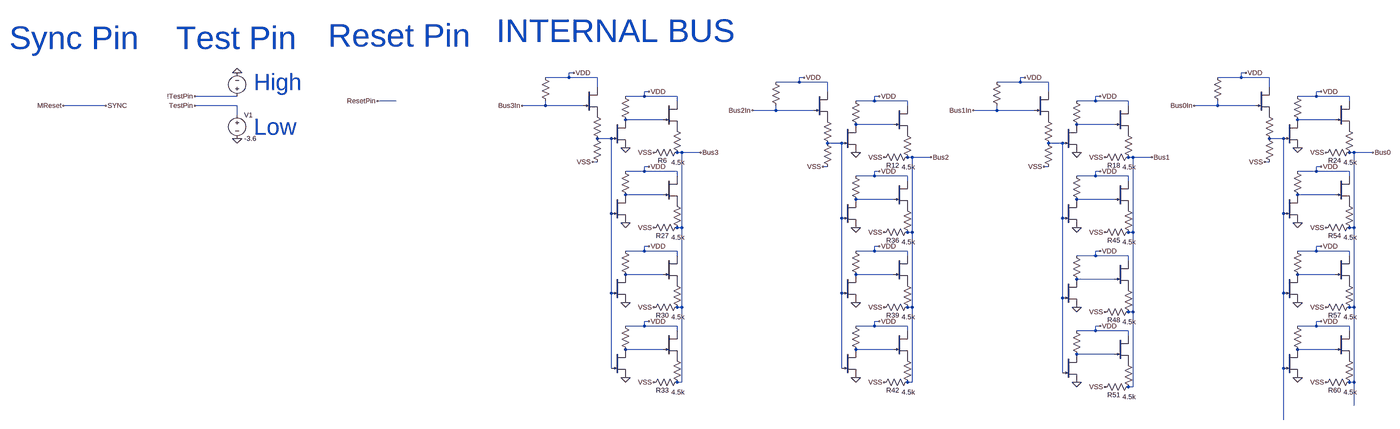
[diagram p0: schematic pins.asc, whole sheet]
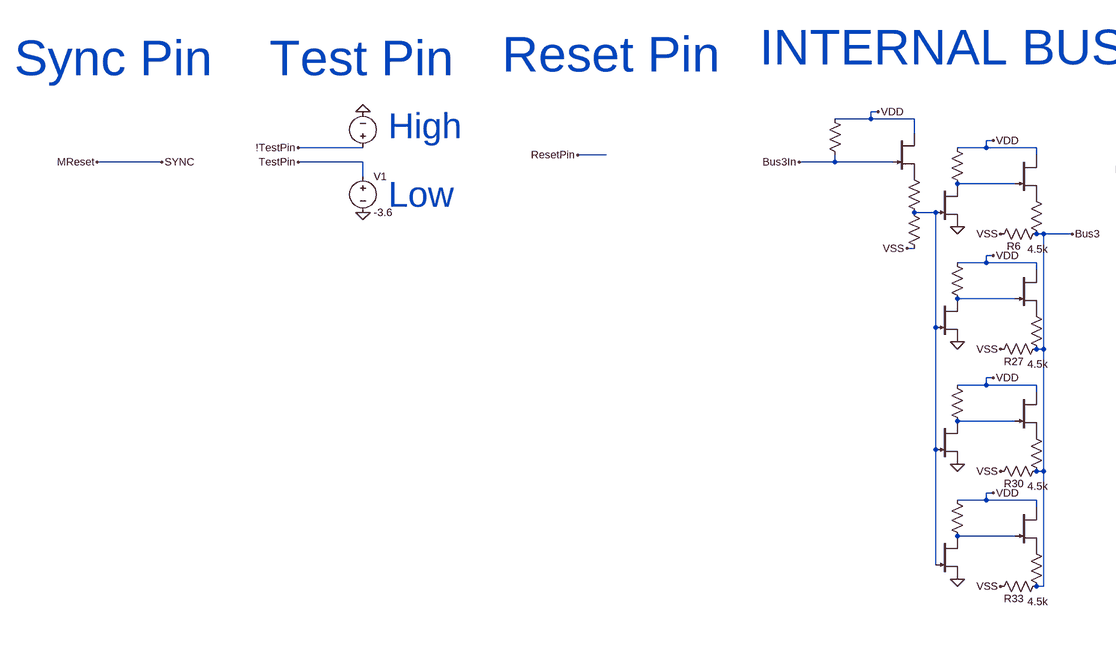
[diagram p1: schematic pins.asc, part, row 1 of 1, column 1 of 2]
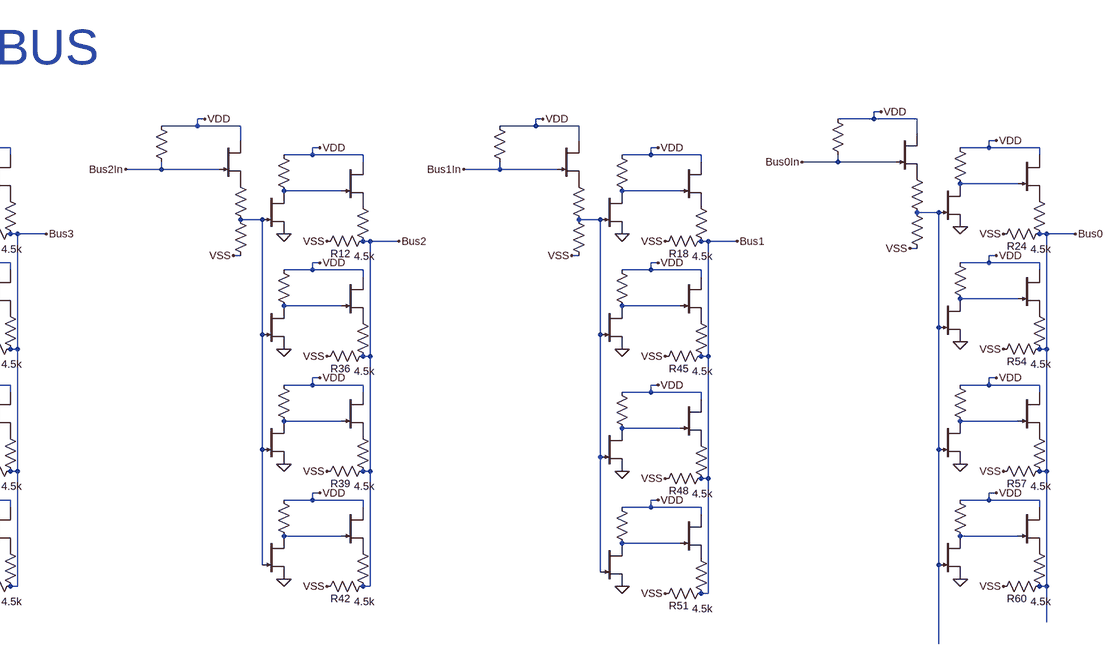
[diagram p2: schematic pins.asc, part, row 1 of 1, column 2 of 2]
pins.asc, the LTspice schematic file:
Version 4.1
SHEET 1 109444 42780
WIRE 21760 -5312 21744 -5312
WIRE 24048 -5312 24032 -5312
WIRE 21744 -5296 21744 -5312
WIRE 21744 -5296 21664 -5296
WIRE 21840 -5296 21744 -5296
WIRE 22544 -5296 22528 -5296
WIRE 23296 -5296 23280 -5296
WIRE 24032 -5296 24032 -5312
WIRE 24032 -5296 23952 -5296
WIRE 24128 -5296 24032 -5296
WIRE 22528 -5280 22528 -5296
WIRE 22528 -5280 22448 -5280
WIRE 22624 -5280 22528 -5280
WIRE 23280 -5280 23280 -5296
WIRE 23280 -5280 23200 -5280
WIRE 23376 -5280 23280 -5280
WIRE 21840 -5264 21840 -5296
WIRE 24128 -5264 24128 -5296
WIRE 22016 -5248 22000 -5248
WIRE 22624 -5248 22624 -5280
WIRE 23376 -5248 23376 -5280
WIRE 24304 -5248 24288 -5248
WIRE 20064 -5232 19920 -5232
WIRE 22000 -5232 22000 -5248
WIRE 22000 -5232 21936 -5232
WIRE 22112 -5232 22000 -5232
WIRE 22800 -5232 22784 -5232
WIRE 23552 -5232 23536 -5232
WIRE 24288 -5232 24288 -5248
WIRE 24288 -5232 24224 -5232
WIRE 24400 -5232 24288 -5232
WIRE 20944 -5216 20880 -5216
WIRE 22112 -5216 22112 -5232
WIRE 22784 -5216 22784 -5232
WIRE 22784 -5216 22720 -5216
WIRE 22896 -5216 22784 -5216
WIRE 23536 -5216 23536 -5232
WIRE 23536 -5216 23472 -5216
WIRE 23648 -5216 23536 -5216
WIRE 24400 -5216 24400 -5232
WIRE 19440 -5200 19296 -5200
WIRE 20064 -5200 19920 -5200
WIRE 21664 -5200 21664 -5216
WIRE 21664 -5200 21584 -5200
WIRE 21792 -5200 21664 -5200
WIRE 22896 -5200 22896 -5216
WIRE 23648 -5200 23648 -5216
WIRE 23952 -5200 23952 -5216
WIRE 23952 -5200 23872 -5200
WIRE 24080 -5200 23952 -5200
WIRE 22448 -5184 22448 -5200
WIRE 22448 -5184 22368 -5184
WIRE 22576 -5184 22448 -5184
WIRE 23200 -5184 23200 -5200
WIRE 23200 -5184 23120 -5184
WIRE 23328 -5184 23200 -5184
WIRE 20064 -5168 20064 -5200
WIRE 22064 -5152 21936 -5152
WIRE 24352 -5152 24224 -5152
WIRE 22848 -5136 22720 -5136
WIRE 23600 -5136 23472 -5136
WIRE 21888 -5088 21840 -5088
WIRE 24176 -5088 24128 -5088
WIRE 22672 -5072 22624 -5072
WIRE 23424 -5072 23376 -5072
WIRE 22128 -5040 22112 -5040
WIRE 22192 -5040 22128 -5040
WIRE 24416 -5040 24400 -5040
WIRE 24480 -5040 24416 -5040
WIRE 22912 -5024 22896 -5024
WIRE 22976 -5024 22912 -5024
WIRE 23664 -5024 23648 -5024
WIRE 23728 -5024 23664 -5024
WIRE 21840 -5008 21824 -5008
WIRE 24128 -5008 24112 -5008
WIRE 22016 -4992 22000 -4992
WIRE 22624 -4992 22608 -4992
WIRE 23376 -4992 23360 -4992
WIRE 24304 -4992 24288 -4992
WIRE 22000 -4976 22000 -4992
WIRE 22000 -4976 21936 -4976
WIRE 22112 -4976 22000 -4976
WIRE 22800 -4976 22784 -4976
WIRE 23552 -4976 23536 -4976
WIRE 24288 -4976 24288 -4992
WIRE 24288 -4976 24224 -4976
WIRE 24400 -4976 24288 -4976
WIRE 22112 -4960 22112 -4976
WIRE 22784 -4960 22784 -4976
WIRE 22784 -4960 22720 -4960
WIRE 22896 -4960 22784 -4960
WIRE 23536 -4960 23536 -4976
WIRE 23536 -4960 23472 -4960
WIRE 23648 -4960 23536 -4960
WIRE 24400 -4960 24400 -4976
WIRE 22896 -4944 22896 -4960
WIRE 23648 -4944 23648 -4960
WIRE 22064 -4896 21936 -4896
WIRE 24352 -4896 24224 -4896
WIRE 22848 -4880 22720 -4880
WIRE 23600 -4880 23472 -4880
WIRE 21888 -4832 21888 -5088
WIRE 24176 -4832 24176 -5088
WIRE 22672 -4816 22672 -5072
WIRE 23424 -4816 23424 -5072
WIRE 22128 -4784 22128 -5040
WIRE 22128 -4784 22112 -4784
WIRE 24416 -4784 24416 -5040
WIRE 24416 -4784 24400 -4784
WIRE 22912 -4768 22912 -5024
WIRE 22912 -4768 22896 -4768
WIRE 23664 -4768 23664 -5024
WIRE 23664 -4768 23648 -4768
WIRE 22016 -4720 22000 -4720
WIRE 22800 -4720 22784 -4720
WIRE 24304 -4720 24288 -4720
WIRE 22000 -4704 22000 -4720
WIRE 22000 -4704 21936 -4704
WIRE 22112 -4704 22000 -4704
WIRE 22784 -4704 22784 -4720
WIRE 22784 -4704 22720 -4704
WIRE 22896 -4704 22784 -4704
WIRE 23552 -4704 23536 -4704
WIRE 24288 -4704 24288 -4720
WIRE 24288 -4704 24224 -4704
WIRE 24400 -4704 24288 -4704
WIRE 22112 -4688 22112 -4704
WIRE 22896 -4688 22896 -4704
WIRE 23536 -4688 23536 -4704
WIRE 23536 -4688 23472 -4688
WIRE 23648 -4688 23536 -4688
WIRE 24400 -4688 24400 -4704
WIRE 23648 -4672 23648 -4688
WIRE 22064 -4624 21936 -4624
WIRE 22848 -4624 22720 -4624
WIRE 24352 -4624 24224 -4624
WIRE 23600 -4608 23472 -4608
WIRE 21888 -4560 21888 -4832
WIRE 22672 -4560 22672 -4816
WIRE 24176 -4560 24176 -4832
WIRE 23424 -4544 23424 -4816
WIRE 22128 -4512 22128 -4784
WIRE 22128 -4512 22112 -4512
WIRE 22912 -4512 22912 -4768
WIRE 22912 -4512 22896 -4512
WIRE 24416 -4512 24416 -4784
WIRE 24416 -4512 24400 -4512
WIRE 23664 -4496 23664 -4768
WIRE 23664 -4496 23648 -4496
WIRE 22016 -4464 22000 -4464
WIRE 22800 -4464 22784 -4464
WIRE 24304 -4464 24288 -4464
WIRE 22000 -4448 22000 -4464
WIRE 22000 -4448 21936 -4448
WIRE 22112 -4448 22000 -4448
WIRE 22784 -4448 22784 -4464
WIRE 22784 -4448 22720 -4448
WIRE 22896 -4448 22784 -4448
WIRE 23552 -4448 23536 -4448
WIRE 24288 -4448 24288 -4464
WIRE 24288 -4448 24224 -4448
WIRE 24400 -4448 24288 -4448
WIRE 22112 -4432 22112 -4448
WIRE 22896 -4432 22896 -4448
WIRE 23536 -4432 23536 -4448
WIRE 23536 -4432 23472 -4432
WIRE 23648 -4432 23536 -4432
WIRE 24400 -4432 24400 -4448
WIRE 23648 -4416 23648 -4432
WIRE 22064 -4368 21936 -4368
WIRE 22848 -4368 22720 -4368
WIRE 24352 -4368 24224 -4368
WIRE 23600 -4352 23472 -4352
WIRE 21888 -4304 21888 -4560
WIRE 22672 -4304 22672 -4560
WIRE 24176 -4304 24176 -4560
WIRE 23424 -4288 23424 -4544
WIRE 22128 -4256 22128 -4512
WIRE 22128 -4256 22112 -4256
WIRE 22912 -4256 22912 -4512
WIRE 22912 -4256 22896 -4256
WIRE 24416 -4256 24416 -4512
WIRE 24416 -4256 24400 -4256
WIRE 23664 -4240 23664 -4496
WIRE 23664 -4240 23648 -4240
WIRE 24416 -4176 24416 -4256
WIRE 24176 -4128 24176 -4304
FLAG 19296 -5200 MReset
FLAG 19440 -5200 SYNC
FLAG 19920 -5200 TestPin
FLAG 20064 -5312 0
FLAG 20064 -5088 0
FLAG 20880 -5216 ResetPin
FLAG 21936 -5056 0
FLAG 21760 -5312 VDD
FLAG 22016 -5248 VDD
FLAG 21824 -5008 VSS
FLAG 22032 -5040 VSS
FLAG 22720 -5040 0
FLAG 22544 -5296 VDD
FLAG 22800 -5232 VDD
FLAG 22608 -4992 VSS
FLAG 22816 -5024 VSS
FLAG 23472 -5040 0
FLAG 23296 -5296 VDD
FLAG 23552 -5232 VDD
FLAG 23360 -4992 VSS
FLAG 23568 -5024 VSS
FLAG 24224 -5056 0
FLAG 24048 -5312 VDD
FLAG 24304 -5248 VDD
FLAG 24320 -5040 VSS
FLAG 22192 -5040 Bus3
FLAG 22976 -5024 Bus2
FLAG 23728 -5024 Bus1
FLAG 24480 -5040 Bus0
FLAG 21584 -5200 Bus3In
FLAG 22368 -5184 Bus2In
FLAG 23120 -5184 Bus1In
FLAG 23872 -5200 Bus0In
FLAG 21936 -4800 0
FLAG 22016 -4992 VDD
FLAG 22032 -4784 VSS
FLAG 21936 -4528 0
FLAG 22016 -4720 VDD
FLAG 22032 -4512 VSS
FLAG 21936 -4272 0
FLAG 22016 -4464 VDD
FLAG 22032 -4256 VSS
FLAG 22720 -4784 0
FLAG 22800 -4976 VDD
FLAG 22816 -4768 VSS
FLAG 22720 -4528 0
FLAG 22800 -4720 VDD
FLAG 22816 -4512 VSS
FLAG 22720 -4272 0
FLAG 22800 -4464 VDD
FLAG 22816 -4256 VSS
FLAG 23472 -4784 0
FLAG 23552 -4976 VDD
FLAG 23568 -4768 VSS
FLAG 23472 -4512 0
FLAG 23552 -4704 VDD
FLAG 23568 -4496 VSS
FLAG 23472 -4256 0
FLAG 23552 -4448 VDD
FLAG 23568 -4240 VSS
FLAG 24112 -5008 VSS
FLAG 24224 -4800 0
FLAG 24304 -4992 VDD
FLAG 24320 -4784 VSS
FLAG 24224 -4528 0
FLAG 24304 -4720 VDD
FLAG 24320 -4512 VSS
FLAG 24224 -4272 0
FLAG 24304 -4464 VDD
FLAG 24320 -4256 VSS
FLAG 19920 -5232 !TestPin
SYMBOL voltage 20064 -5184 R0
WINDOW 123 0 0 Left 0
WINDOW 39 0 0 Left 0
SYMATTR InstName V1
SYMATTR Value -3.6
SYMBOL voltage 20064 -5216 R180
WINDOW 0 24 96 Invisible 2
WINDOW 3 24 16 Invisible 2
WINDOW 123 0 0 Left 0
WINDOW 39 0 0 Left 0
SYMATTR InstName V2
SYMATTR Value -800m
SYMBOL res 21648 -5312 R0
WINDOW 0 -35 57 Invisible 2
WINDOW 3 34 56 Invisible 2
SYMATTR InstName R1
SYMATTR Value 100k
SYMBOL njf 21792 -5264 R0
WINDOW 0 56 32 Invisible 2
WINDOW 3 56 72 Invisible 2
SYMATTR InstName J_F1
SYMATTR Value DR
SYMBOL res 21824 -5184 R0
WINDOW 0 -24 60 Invisible 2
WINDOW 3 34 58 Invisible 2
SYMATTR InstName R2
SYMATTR Value 1k
SYMBOL res 21824 -5104 R0
WINDOW 0 -22 62 Invisible 2
WINDOW 3 37 62 Invisible 2
SYMATTR InstName R3
SYMATTR Value 4.8k
SYMBOL njf 21888 -5152 R0
WINDOW 0 56 32 Invisible 2
WINDOW 3 56 72 Invisible 2
SYMATTR InstName J_A1
SYMATTR Value DR
SYMBOL res 21920 -5248 R0
WINDOW 0 56 32 Invisible 2
WINDOW 3 56 72 Invisible 2
SYMATTR InstName R4
SYMATTR Value 50k
SYMBOL njf 22064 -5216 R0
WINDOW 0 56 32 Invisible 2
WINDOW 3 56 72 Invisible 2
SYMATTR InstName J_A2
SYMATTR Value DR
SYMBOL res 22096 -5136 R0
WINDOW 0 37 24 Invisible 2
WINDOW 3 -30 25 Invisible 2
SYMATTR InstName R5
SYMATTR Value 1k
SYMBOL res 22128 -5056 R90
WINDOW 0 59 66 VBottom 2
WINDOW 3 34 13 VTop 2
SYMATTR InstName R6
SYMATTR Value 4.5k
SYMBOL res 22432 -5296 R0
WINDOW 0 -35 57 Invisible 2
WINDOW 3 34 56 Invisible 2
SYMATTR InstName R7
SYMATTR Value 100k
SYMBOL njf 22576 -5248 R0
WINDOW 0 56 32 Invisible 2
WINDOW 3 56 72 Invisible 2
SYMATTR InstName J_F2
SYMATTR Value DR
SYMBOL res 22608 -5168 R0
WINDOW 0 -24 60 Invisible 2
WINDOW 3 34 58 Invisible 2
SYMATTR InstName R8
SYMATTR Value 1k
SYMBOL res 22608 -5088 R0
WINDOW 0 -22 62 Invisible 2
WINDOW 3 37 62 Invisible 2
SYMATTR InstName R9
SYMATTR Value 4.8k
SYMBOL njf 22672 -5136 R0
WINDOW 0 56 32 Invisible 2
WINDOW 3 56 72 Invisible 2
SYMATTR InstName J_A3
SYMATTR Value DR
SYMBOL res 22704 -5232 R0
WINDOW 0 56 32 Invisible 2
WINDOW 3 56 72 Invisible 2
SYMATTR InstName R10
SYMATTR Value 50k
SYMBOL njf 22848 -5200 R0
WINDOW 0 56 32 Invisible 2
WINDOW 3 56 72 Invisible 2
SYMATTR InstName J_A4
SYMATTR Value DR
SYMBOL res 22880 -5120 R0
WINDOW 0 37 24 Invisible 2
WINDOW 3 -30 25 Invisible 2
SYMATTR InstName R11
SYMATTR Value 1k
SYMBOL res 22912 -5040 R90
WINDOW 0 59 66 VBottom 2
WINDOW 3 34 13 VTop 2
SYMATTR InstName R12
SYMATTR Value 4.5k
SYMBOL res 23184 -5296 R0
WINDOW 0 -35 57 Invisible 2
WINDOW 3 34 56 Invisible 2
SYMATTR InstName R13
SYMATTR Value 100k
SYMBOL njf 23328 -5248 R0
WINDOW 0 56 32 Invisible 2
WINDOW 3 56 72 Invisible 2
SYMATTR InstName J_F3
SYMATTR Value DR
SYMBOL res 23360 -5168 R0
WINDOW 0 -24 60 Invisible 2
WINDOW 3 34 58 Invisible 2
SYMATTR InstName R14
SYMATTR Value 1k
SYMBOL res 23360 -5088 R0
WINDOW 0 -22 62 Invisible 2
WINDOW 3 37 62 Invisible 2
SYMATTR InstName R15
SYMATTR Value 4.8k
SYMBOL njf 23424 -5136 R0
WINDOW 0 56 32 Invisible 2
WINDOW 3 56 72 Invisible 2
SYMATTR InstName J_A5
SYMATTR Value DR
SYMBOL res 23456 -5232 R0
WINDOW 0 56 32 Invisible 2
WINDOW 3 56 72 Invisible 2
SYMATTR InstName R16
SYMATTR Value 50k
SYMBOL njf 23600 -5200 R0
WINDOW 0 56 32 Invisible 2
WINDOW 3 56 72 Invisible 2
SYMATTR InstName J_A6
SYMATTR Value DR
SYMBOL res 23632 -5120 R0
WINDOW 0 37 24 Invisible 2
WINDOW 3 -30 25 Invisible 2
SYMATTR InstName R17
SYMATTR Value 1k
SYMBOL res 23664 -5040 R90
WINDOW 0 59 66 VBottom 2
WINDOW 3 34 13 VTop 2
SYMATTR InstName R18
SYMATTR Value 4.5k
SYMBOL res 23936 -5312 R0
WINDOW 0 -35 57 Invisible 2
WINDOW 3 34 56 Invisible 2
SYMATTR InstName R19
SYMATTR Value 100k
SYMBOL njf 24080 -5264 R0
WINDOW 0 56 32 Invisible 2
WINDOW 3 56 72 Invisible 2
SYMATTR InstName J_F4
SYMATTR Value DR
SYMBOL res 24112 -5184 R0
WINDOW 0 -24 60 Invisible 2
WINDOW 3 34 58 Invisible 2
SYMATTR InstName R20
SYMATTR Value 1k
SYMBOL res 24112 -5104 R0
WINDOW 0 -22 62 Invisible 2
WINDOW 3 37 62 Invisible 2
SYMATTR InstName R21
SYMATTR Value 4.8k
SYMBOL njf 24176 -5152 R0
WINDOW 0 56 32 Invisible 2
WINDOW 3 56 72 Invisible 2
SYMATTR InstName J_A7
SYMATTR Value DR
SYMBOL res 24208 -5248 R0
WINDOW 0 56 32 Invisible 2
WINDOW 3 56 72 Invisible 2
SYMATTR InstName R22
SYMATTR Value 50k
SYMBOL njf 24352 -5216 R0
WINDOW 0 56 32 Invisible 2
WINDOW 3 56 72 Invisible 2
SYMATTR InstName J_A8
SYMATTR Value DR
SYMBOL res 24384 -5136 R0
WINDOW 0 37 24 Invisible 2
WINDOW 3 -30 25 Invisible 2
SYMATTR InstName R23
SYMATTR Value 1k
SYMBOL res 24416 -5056 R90
WINDOW 0 59 66 VBottom 2
WINDOW 3 34 13 VTop 2
SYMATTR InstName R24
SYMATTR Value 4.5k
SYMBOL njf 21888 -4896 R0
WINDOW 0 56 32 Invisible 2
WINDOW 3 56 72 Invisible 2
SYMATTR InstName J_A9
SYMATTR Value DR
SYMBOL res 21920 -4992 R0
WINDOW 0 56 32 Invisible 2
WINDOW 3 56 72 Invisible 2
SYMATTR InstName R25
SYMATTR Value 50k
SYMBOL njf 22064 -4960 R0
WINDOW 0 56 32 Invisible 2
WINDOW 3 56 72 Invisible 2
SYMATTR InstName J_A10
SYMATTR Value DR
SYMBOL res 22096 -4880 R0
WINDOW 0 37 24 Invisible 2
WINDOW 3 -30 25 Invisible 2
SYMATTR InstName R26
SYMATTR Value 1k
SYMBOL res 22128 -4800 R90
WINDOW 0 59 66 VBottom 2
WINDOW 3 34 13 VTop 2
SYMATTR InstName R27
SYMATTR Value 4.5k
SYMBOL njf 21888 -4624 R0
WINDOW 0 56 32 Invisible 2
WINDOW 3 56 72 Invisible 2
SYMATTR InstName J_A11
SYMATTR Value DR
SYMBOL res 21920 -4720 R0
WINDOW 0 56 32 Invisible 2
WINDOW 3 56 72 Invisible 2
SYMATTR InstName R28
SYMATTR Value 50k
SYMBOL njf 22064 -4688 R0
WINDOW 0 56 32 Invisible 2
WINDOW 3 56 72 Invisible 2
SYMATTR InstName J_A12
SYMATTR Value DR
SYMBOL res 22096 -4608 R0
WINDOW 0 37 24 Invisible 2
WINDOW 3 -30 25 Invisible 2
SYMATTR InstName R29
SYMATTR Value 1k
SYMBOL res 22128 -4528 R90
WINDOW 0 59 66 VBottom 2
WINDOW 3 34 13 VTop 2
SYMATTR InstName R30
SYMATTR Value 4.5k
SYMBOL njf 21888 -4368 R0
WINDOW 0 56 32 Invisible 2
WINDOW 3 56 72 Invisible 2
SYMATTR InstName J_A13
SYMATTR Value DR
SYMBOL res 21920 -4464 R0
WINDOW 0 56 32 Invisible 2
WINDOW 3 56 72 Invisible 2
SYMATTR InstName R31
SYMATTR Value 50k
SYMBOL njf 22064 -4432 R0
WINDOW 0 56 32 Invisible 2
WINDOW 3 56 72 Invisible 2
SYMATTR InstName J_A14
SYMATTR Value DR
SYMBOL res 22096 -4352 R0
WINDOW 0 37 24 Invisible 2
WINDOW 3 -30 25 Invisible 2
SYMATTR InstName R32
SYMATTR Value 1k
SYMBOL res 22128 -4272 R90
WINDOW 0 59 66 VBottom 2
WINDOW 3 34 13 VTop 2
SYMATTR InstName R33
SYMATTR Value 4.5k
SYMBOL njf 22672 -4880 R0
WINDOW 0 56 32 Invisible 2
WINDOW 3 56 72 Invisible 2
SYMATTR InstName J_A15
SYMATTR Value DR
SYMBOL res 22704 -4976 R0
WINDOW 0 56 32 Invisible 2
WINDOW 3 56 72 Invisible 2
SYMATTR InstName R34
SYMATTR Value 50k
SYMBOL njf 22848 -4944 R0
WINDOW 0 56 32 Invisible 2
WINDOW 3 56 72 Invisible 2
SYMATTR InstName J_A16
SYMATTR Value DR
SYMBOL res 22880 -4864 R0
WINDOW 0 37 24 Invisible 2
WINDOW 3 -30 25 Invisible 2
SYMATTR InstName R35
SYMATTR Value 1k
SYMBOL res 22912 -4784 R90
WINDOW 0 59 66 VBottom 2
WINDOW 3 34 13 VTop 2
SYMATTR InstName R36
SYMATTR Value 4.5k
SYMBOL njf 22672 -4624 R0
WINDOW 0 56 32 Invisible 2
WINDOW 3 56 72 Invisible 2
SYMATTR InstName J_A17
SYMATTR Value DR
SYMBOL res 22704 -4720 R0
WINDOW 0 56 32 Invisible 2
WINDOW 3 56 72 Invisible 2
SYMATTR InstName R37
SYMATTR Value 50k
SYMBOL njf 22848 -4688 R0
WINDOW 0 56 32 Invisible 2
WINDOW 3 56 72 Invisible 2
SYMATTR InstName J_A18
SYMATTR Value DR
SYMBOL res 22880 -4608 R0
WINDOW 0 37 24 Invisible 2
WINDOW 3 -30 25 Invisible 2
SYMATTR InstName R38
SYMATTR Value 1k
SYMBOL res 22912 -4528 R90
WINDOW 0 59 66 VBottom 2
WINDOW 3 34 13 VTop 2
SYMATTR InstName R39
SYMATTR Value 4.5k
SYMBOL njf 22672 -4368 R0
WINDOW 0 56 32 Invisible 2
WINDOW 3 56 72 Invisible 2
SYMATTR InstName J_A19
SYMATTR Value DR
SYMBOL res 22704 -4464 R0
WINDOW 0 56 32 Invisible 2
WINDOW 3 56 72 Invisible 2
SYMATTR InstName R40
SYMATTR Value 50k
SYMBOL njf 22848 -4432 R0
WINDOW 0 56 32 Invisible 2
WINDOW 3 56 72 Invisible 2
SYMATTR InstName J_A20
SYMATTR Value DR
SYMBOL res 22880 -4352 R0
WINDOW 0 37 24 Invisible 2
WINDOW 3 -30 25 Invisible 2
SYMATTR InstName R41
SYMATTR Value 1k
SYMBOL res 22912 -4272 R90
WINDOW 0 59 66 VBottom 2
WINDOW 3 34 13 VTop 2
SYMATTR InstName R42
SYMATTR Value 4.5k
SYMBOL njf 23424 -4880 R0
WINDOW 0 56 32 Invisible 2
WINDOW 3 56 72 Invisible 2
SYMATTR InstName J_A21
SYMATTR Value DR
SYMBOL res 23456 -4976 R0
WINDOW 0 56 32 Invisible 2
WINDOW 3 56 72 Invisible 2
SYMATTR InstName R43
SYMATTR Value 50k
SYMBOL njf 23600 -4944 R0
WINDOW 0 56 32 Invisible 2
WINDOW 3 56 72 Invisible 2
SYMATTR InstName J_A22
SYMATTR Value DR
SYMBOL res 23632 -4864 R0
WINDOW 0 37 24 Invisible 2
WINDOW 3 -30 25 Invisible 2
SYMATTR InstName R44
SYMATTR Value 1k
SYMBOL res 23664 -4784 R90
WINDOW 0 59 66 VBottom 2
WINDOW 3 34 13 VTop 2
SYMATTR InstName R45
SYMATTR Value 4.5k
SYMBOL njf 23424 -4608 R0
WINDOW 0 56 32 Invisible 2
WINDOW 3 56 72 Invisible 2
SYMATTR InstName J_A23
SYMATTR Value DR
SYMBOL res 23456 -4704 R0
WINDOW 0 56 32 Invisible 2
WINDOW 3 56 72 Invisible 2
SYMATTR InstName R46
SYMATTR Value 50k
SYMBOL njf 23600 -4672 R0
WINDOW 0 56 32 Invisible 2
WINDOW 3 56 72 Invisible 2
SYMATTR InstName J_A24
SYMATTR Value DR
SYMBOL res 23632 -4592 R0
WINDOW 0 37 24 Invisible 2
WINDOW 3 -30 25 Invisible 2
SYMATTR InstName R47
SYMATTR Value 1k
SYMBOL res 23664 -4512 R90
WINDOW 0 59 66 VBottom 2
WINDOW 3 34 13 VTop 2
SYMATTR InstName R48
SYMATTR Value 4.5k
SYMBOL njf 23424 -4352 R0
WINDOW 0 56 32 Invisible 2
WINDOW 3 56 72 Invisible 2
SYMATTR InstName J_A25
SYMATTR Value DR
SYMBOL res 23456 -4448 R0
WINDOW 0 56 32 Invisible 2
WINDOW 3 56 72 Invisible 2
SYMATTR InstName R49
SYMATTR Value 50k
SYMBOL njf 23600 -4416 R0
WINDOW 0 56 32 Invisible 2
WINDOW 3 56 72 Invisible 2
SYMATTR InstName J_A26
SYMATTR Value DR
SYMBOL res 23632 -4336 R0
WINDOW 0 37 24 Invisible 2
WINDOW 3 -30 25 Invisible 2
SYMATTR InstName R50
SYMATTR Value 1k
SYMBOL res 23664 -4256 R90
WINDOW 0 59 66 VBottom 2
WINDOW 3 34 13 VTop 2
SYMATTR InstName R51
SYMATTR Value 4.5k
SYMBOL njf 24176 -4896 R0
WINDOW 0 56 32 Invisible 2
WINDOW 3 56 72 Invisible 2
SYMATTR InstName J_A27
SYMATTR Value DR
SYMBOL res 24208 -4992 R0
WINDOW 0 56 32 Invisible 2
WINDOW 3 56 72 Invisible 2
SYMATTR InstName R52
SYMATTR Value 50k
SYMBOL njf 24352 -4960 R0
WINDOW 0 56 32 Invisible 2
WINDOW 3 56 72 Invisible 2
SYMATTR InstName J_A28
SYMATTR Value DR
SYMBOL res 24384 -4880 R0
WINDOW 0 37 24 Invisible 2
WINDOW 3 -30 25 Invisible 2
SYMATTR InstName R53
SYMATTR Value 1k
SYMBOL res 24416 -4800 R90
WINDOW 0 59 66 VBottom 2
WINDOW 3 34 13 VTop 2
SYMATTR InstName R54
SYMATTR Value 4.5k
SYMBOL njf 24176 -4624 R0
WINDOW 0 56 32 Invisible 2
WINDOW 3 56 72 Invisible 2
SYMATTR InstName J_A29
SYMATTR Value DR
SYMBOL res 24208 -4720 R0
WINDOW 0 56 32 Invisible 2
WINDOW 3 56 72 Invisible 2
SYMATTR InstName R55
SYMATTR Value 50k
SYMBOL njf 24352 -4688 R0
WINDOW 0 56 32 Invisible 2
WINDOW 3 56 72 Invisible 2
SYMATTR InstName J_A30
SYMATTR Value DR
SYMBOL res 24384 -4608 R0
WINDOW 0 37 24 Invisible 2
WINDOW 3 -30 25 Invisible 2
SYMATTR InstName R56
SYMATTR Value 1k
SYMBOL res 24416 -4528 R90
WINDOW 0 59 66 VBottom 2
WINDOW 3 34 13 VTop 2
SYMATTR InstName R57
SYMATTR Value 4.5k
SYMBOL njf 24176 -4368 R0
WINDOW 0 56 32 Invisible 2
WINDOW 3 56 72 Invisible 2
SYMATTR InstName J_A31
SYMATTR Value DR
SYMBOL res 24208 -4464 R0
WINDOW 0 56 32 Invisible 2
WINDOW 3 56 72 Invisible 2
SYMATTR InstName R58
SYMATTR Value 50k
SYMBOL njf 24352 -4432 R0
WINDOW 0 56 32 Invisible 2
WINDOW 3 56 72 Invisible 2
SYMATTR InstName J_A32
SYMATTR Value DR
SYMBOL res 24384 -4352 R0
WINDOW 0 37 24 Invisible 2
WINDOW 3 -30 25 Invisible 2
SYMATTR InstName R59
SYMATTR Value 1k
SYMBOL res 24416 -4272 R90
WINDOW 0 59 66 VBottom 2
WINDOW 3 34 13 VTop 2
SYMATTR InstName R60
SYMATTR Value 4.5k
TEXT 19112 -5432 Left 7 ;Sync Pin
TEXT 19856 -5432 Left 7 ;Test Pin
TEXT 20120 -5280 Left 6 ;High
TEXT 20120 -5128 Left 6 ;Low
TEXT 20712 -5440 Left 7 ;Reset Pin
TEXT 21496 -5456 Left 7 ;INTERNAL BUS

The netlist it stands for:
* pins.asc
V1 TestPin 0 -3.6
V2 !TestPin 0 -800m
R1 VDD Bus3In 100k
J_F1 VDD Bus3In P001 DR
R2 P001 N005 1k
R3 N005 VSS 4.8k
J_A1 N001 N005 0 DR
R4 VDD N001 50k
J_A2 VDD N001 P002 DR
R5 P002 Bus3 1k
R6 Bus3 VSS 4.5k
R7 VDD Bus2In 100k
J_F2 VDD Bus2In P003 DR
R8 P003 N007 1k
R9 N007 VSS 4.8k
J_A3 N003 N007 0 DR
R10 VDD N003 50k
J_A4 VDD N003 P004 DR
R11 P004 Bus2 1k
R12 Bus2 VSS 4.5k
R13 VDD Bus1In 100k
J_F3 VDD Bus1In P005 DR
R14 P005 N008 1k
R15 N008 VSS 4.8k
J_A5 N004 N008 0 DR
R16 VDD N004 50k
J_A6 VDD N004 P006 DR
R17 P006 Bus1 1k
R18 Bus1 VSS 4.5k
R19 VDD Bus0In 100k
J_F4 VDD Bus0In P007 DR
R20 P007 N006 1k
R21 N006 VSS 4.8k
J_A7 N002 N006 0 DR
R22 VDD N002 50k
J_A8 VDD N002 P008 DR
R23 P008 Bus0 1k
R24 Bus0 VSS 4.5k
J_A9 N009 N005 0 DR
R25 VDD N009 50k
J_A10 VDD N009 P009 DR
R26 P009 Bus3 1k
R27 Bus3 VSS 4.5k
J_A11 N013 N005 0 DR
R28 VDD N013 50k
J_A12 VDD N013 P010 DR
R29 P010 Bus3 1k
R30 Bus3 VSS 4.5k
J_A13 N017 N005 0 DR
R31 VDD N017 50k
J_A14 VDD N017 P011 DR
R32 P011 Bus3 1k
R33 Bus3 VSS 4.5k
J_A15 N011 N007 0 DR
R34 VDD N011 50k
J_A16 VDD N011 P012 DR
R35 P012 Bus2 1k
R36 Bus2 VSS 4.5k
J_A17 N014 N007 0 DR
R37 VDD N014 50k
J_A18 VDD N014 P013 DR
R38 P013 Bus2 1k
R39 Bus2 VSS 4.5k
J_A19 N018 N007 0 DR
R40 VDD N018 50k
J_A20 VDD N018 P014 DR
R41 P014 Bus2 1k
R42 Bus2 VSS 4.5k
J_A21 N012 N008 0 DR
R43 VDD N012 50k
J_A22 VDD N012 P015 DR
R44 P015 Bus1 1k
R45 Bus1 VSS 4.5k
J_A23 N016 N008 0 DR
R46 VDD N016 50k
J_A24 VDD N016 P016 DR
R47 P016 Bus1 1k
R48 Bus1 VSS 4.5k
J_A25 N020 N008 0 DR
R49 VDD N020 50k
J_A26 VDD N020 P017 DR
R50 P017 Bus1 1k
R51 Bus1 VSS 4.5k
J_A27 N010 N006 0 DR
R52 VDD N010 50k
J_A28 VDD N010 P018 DR
R53 P018 Bus0 1k
R54 Bus0 VSS 4.5k
J_A29 N015 N006 0 DR
R55 VDD N015 50k
J_A30 VDD N015 P019 DR
R56 P019 Bus0 1k
R57 Bus0 VSS 4.5k
J_A31 N019 N006 0 DR
R58 VDD N019 50k
J_A32 VDD N019 P020 DR
R59 P020 Bus0 1k
R60 Bus0 VSS 4.5k
.model NJF NJF
.model PJF PJF
.lib standard.jft
* Sync Pin
* Test Pin
* High
* Low
* Reset Pin
* INTERNAL BUS
.backanno
.end